# Altium schematic sheet Sheet1.SchDoc
size A3
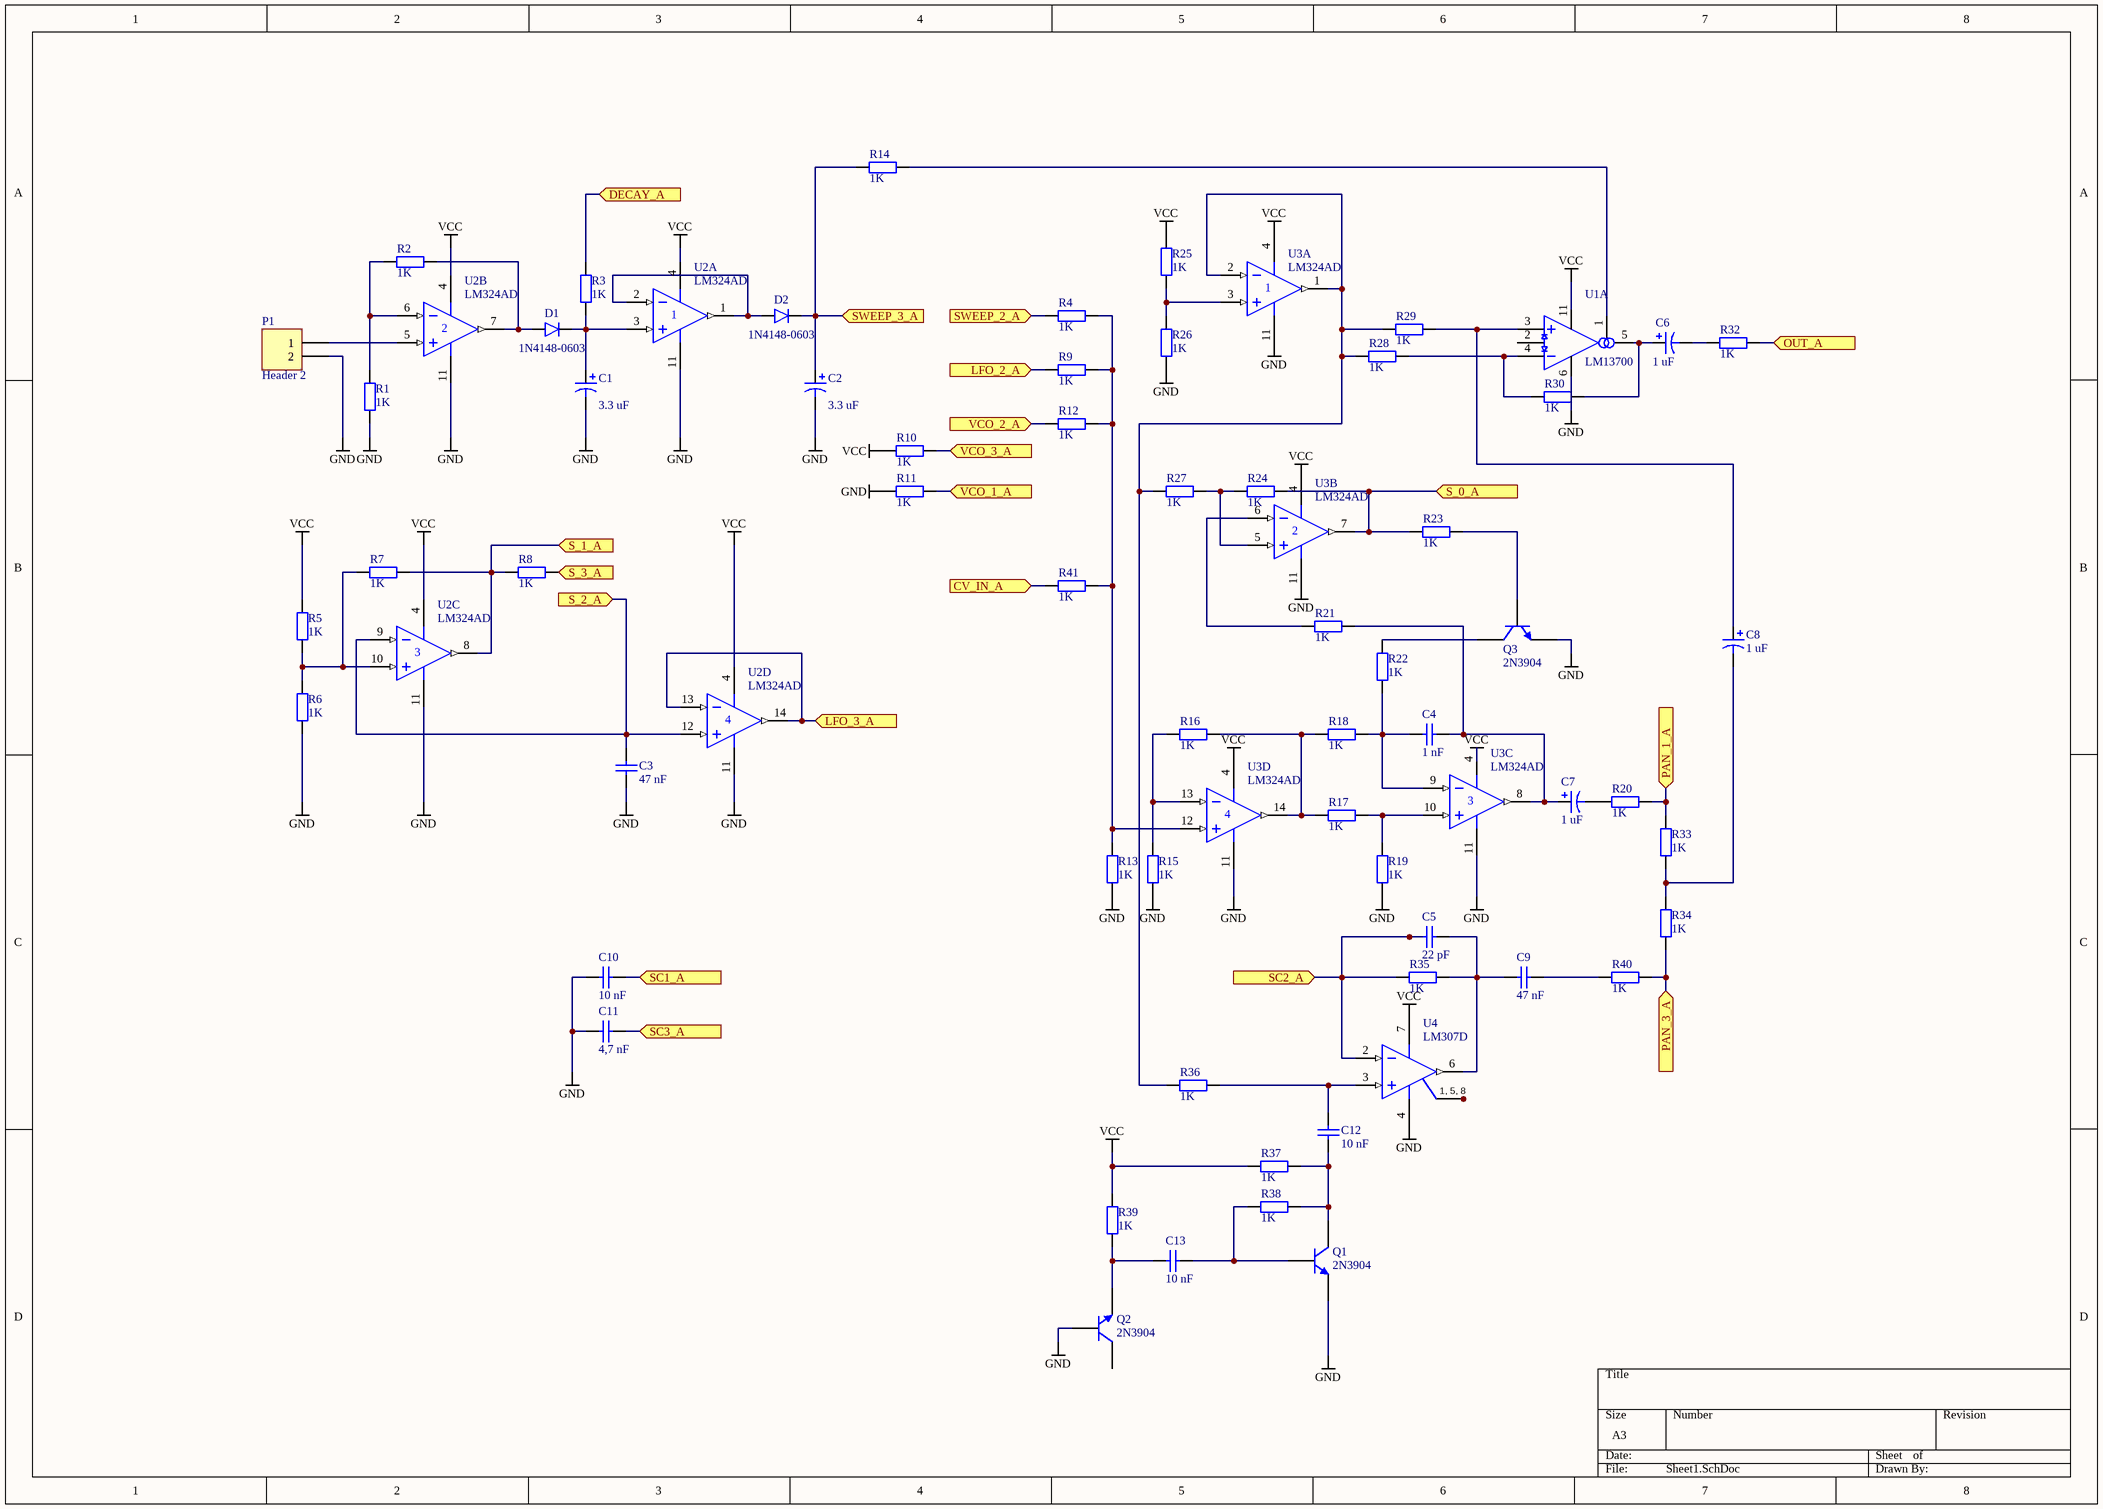
[diagram p0: Sheet1.SchDoc]

## Parts
C1  value 3.3 uF  [C1206]  (hidden comment: Cap Pol1)
C2  value 3.3 uF  [C1206]  (hidden comment: Cap Pol1)
C3  value 47 nF  [C1206]  (hidden comment: Cap)
C4  value 1 nF  [C1206]  (hidden comment: Cap)
C5  value 22 pF  [C1206]  (hidden comment: Cap)
C6  value 1 uF  [C1206]  (hidden comment: Cap Pol1)
C7  value 1 uF  [C1206]  (hidden comment: Cap Pol1)
C8  value 1 uF  [C1206]  (hidden comment: Cap Pol1)
C9  value 47 nF  [C1206]  (hidden comment: Cap)
C10  value 10 nF  [C1206]  (hidden comment: Cap)
C11  value 4,7 nF  [C1206]  (hidden comment: Cap)
C12  value 10 nF  [C1206]  (hidden comment: Cap)
C13  value 10 nF  [C1206]  (hidden comment: Cap)
D1  1N4148-0603  [D0603]
D2  1N4148-0603  [D0603]
P1  Header 2  [HDR1X2]
Q1  2N3904  [TO-92A]
Q2  2N3904  [TO-92A]
Q3  2N3904  [TO-92A]
R1  value 1K  [R1206]  (hidden comment: Res2)
R2  value 1K  [R1206]  (hidden comment: Res2)
R3  value 1K  [R1206]  (hidden comment: Res2)
R4  value 1K  [R1206]  (hidden comment: Res2)
R5  value 1K  [R1206]  (hidden comment: Res2)
R6  value 1K  [R1206]  (hidden comment: Res2)
R7  value 1K  [R1206]  (hidden comment: Res2)
R8  value 1K  [R1206]  (hidden comment: Res2)
R9  value 1K  [R1206]  (hidden comment: Res2)
R10  value 1K  [R1206]  (hidden comment: Res2)
R11  value 1K  [R1206]  (hidden comment: Res2)
R12  value 1K  [R1206]  (hidden comment: Res2)
R13  value 1K  [R1206]  (hidden comment: Res2)
R14  value 1K  [R1206]  (hidden comment: Res2)
R15  value 1K  [R1206]  (hidden comment: Res2)
R16  value 1K  [R1206]  (hidden comment: Res2)
R17  value 1K  [R1206]  (hidden comment: Res2)
R18  value 1K  [R1206]  (hidden comment: Res2)
R19  value 1K  [R1206]  (hidden comment: Res2)
R20  value 1K  [R1206]  (hidden comment: Res2)
R21  value 1K  [R1206]  (hidden comment: Res2)
R22  value 1K  [R1206]  (hidden comment: Res2)
R23  value 1K  [R1206]  (hidden comment: Res2)
R24  value 1K  [R1206]  (hidden comment: Res2)
R25  value 1K  [R1206]  (hidden comment: Res2)
R26  value 1K  [R1206]  (hidden comment: Res2)
R27  value 1K  [R1206]  (hidden comment: Res2)
R28  value 1K  [R1206]  (hidden comment: Res2)
R29  value 1K  [R1206]  (hidden comment: Res2)
R30  value 1K  [R1206]  (hidden comment: Res2)
R32  value 1K  [R1206]  (hidden comment: Res2)
R33  value 1K  [R1206]  (hidden comment: Res2)
R34  value 1K  [R1206]  (hidden comment: Res2)
R35  value 1K  [R1206]  (hidden comment: Res2)
R36  value 1K  [R1206]  (hidden comment: Res2)
R37  value 1K  [R1206]  (hidden comment: Res2)
R38  value 1K  [R1206]  (hidden comment: Res2)
R39  value 1K  [R1206]  (hidden comment: Res2)
R40  value 1K  [R1206]  (hidden comment: Res2)
R41  value 1K  [R1206]  (hidden comment: Res2)
U1  LM13700  [SOIC16]  (part A of 2)
U2  LM324AD  [D014_N]  (parts A,B,C,D of 4)
U3  LM324AD  [D014_N]  (parts A,B,C,D of 4)
U4  LM307D  [D008_L]

## Ports
CV_IN_A, DECAY_A, LFO_2_A, LFO_3_A, OUT_A, PAN_1_A, PAN_3_A, S_0_A, S_1_A, S_2_A, S_3_A, SC1_A, SC2_A, SC3_A, SWEEP_2_A, SWEEP_3_A, VCO_1_A, VCO_2_A, VCO_3_A

## Nets
GND: C1.2 C2.2 C3.1 C10.2 C11.2 P1.2 Q1.1(E) Q2.2(B) Q3.1(E) R1.1 R6.1 R11.2 R13.2 R15.1 R19.2 R26.2 U1.6(V-) U2.11(V-) U3.11(V-) U4.4(V-)
VCC: R5.2 R10.1 R25.1 R37.2 R39.1 U1.11(V+) U2.4(V+) U3.4(V+) U4.7(V+)
CV_IN_A: R41.1 ; port CV_IN_A
DECAY_A: R3.1 ; port DECAY_A
LFO_2_A: R9.2 ; port LFO_2_A
LFO_3_A: U2.13(IN-) U2.14(OUT) ; port LFO_3_A
OUT_A: R32.2 ; port OUT_A
PAN_1_A: R20.2 R33.2 ; port PAN_1_A
PAN_3_A: R34.1 R40.2 ; port PAN_3_A
S_0_A: R23.2 R24.1 U3.7(OUT) ; port S_0_A
S_1_A: R7.1 R8.2 U2.8(OUT) ; port S_1_A
S_2_A: C3.2 U2.9(IN-) U2.12(IN+) ; port S_2_A
S_3_A: R8.1 ; port S_3_A
SC1_A: C10.1 ; port SC1_A
SC2_A: C5.2 R35.2 U4.2(IN-) ; port SC2_A
SC3_A: C11.1 ; port SC3_A
SWEEP_2_A: R4.1 ; port SWEEP_2_A
SWEEP_3_A: C2.1 D2.1 R14.1 ; port SWEEP_3_A
VCO_1_A: R11.1 ; port VCO_1_A
VCO_2_A: R12.2 ; port VCO_2_A
VCO_3_A: R10.2 ; port VCO_3_A
NetC1_1: C1.1 D1.1 R3.2 U2.3(IN+)
NetC4_1: C4.1 C7.1 R21.2 U3.8(OUT)
NetC4_2: C4.2 R18.1 R22.1 U3.9(IN-)
NetC5_1: C5.1 C9.1 R35.1 U4.6(OUT)
NetC6_1: C6.1 R30.2 U1.5(amp_bias)
NetC6_2: C6.2 R32.1
NetC7_2: C7.2 R20.1
NetC8_1: C8.1 R29.2 U1.3(+)
NetC8_2: C8.2 R33.1 R34.2
NetC9_2: C9.2 R40.1
NetC12_1: C12.1 R36.1 U4.3(IN+)
NetC12_2: C12.2 Q1.3(C) R37.1 R38.1
NetC13_1: C13.1 Q2.1(E) R39.2
NetC13_2: C13.2 Q1.2(B) R38.2
NetD1_2: D1.2 R2.1 U2.7(OUT)
NetD2_2: D2.2 U2.1(OUT) U2.2(IN-)
NetP1_1: P1.1 U2.5(IN+)
NetQ3_2: Q3.2(B) R23.1
NetQ3_3: Q3.3(C) R22.2
NetR1_2: R1.2 R2.2 U2.6(IN-)
NetR4_2: R4.2 R9.1 R12.1 R13.1 R41.2 U3.12(IN+)
NetR5_1: R5.1 R6.2 R7.2 U2.10(IN+)
NetR14_2: R14.2 U1.1(amp_bias)
NetR15_2: R15.2 R16.2 U3.13(IN-)
NetR16_1: R16.1 R17.2 R18.2 U3.14(OUT)
NetR17_1: R17.1 R19.1 U3.10(IN+)
NetR21_1: R21.1 U3.6(IN-)
NetR24_2: R24.2 R27.2 U3.5(IN+)
NetR25_2: R25.2 R26.1 U3.3(IN+)
NetR27_1: R27.1 R28.1 R29.1 R36.2 U3.1(OUT) U3.2(IN-)
NetR28_2: R28.2 R30.1 U1.4(amp_bias)
NetU4_1: U4.1(NC) U4.5(NC) U4.8(NC)

Not connected (* = marked no-connect by the designer): Q2 3(C); U1 2(amp_bias)

## Notes on the sheet
- (in symbol LM307D) 1, 5, 8

## Library data of the parts
C1 C2 C6-C8 = Cap Pol1: Polarized Capacitor (Radial); Published: 8-Jun-2000; LatestRevisionDate: 17-Jul-2002; LatestRevisionNote: Re-released for DXP Platform.; PackageReference: RB7.6-15; Publisher: Altium Limited; PackageDescription: Polarized Capacitor (Radial); 2 Leads
C3-C5 C9-C13 = Cap: Capacitor; Published: 8-Jun-2000; LatestRevisionDate: 17-Jul-2002; LatestRevisionNote: Re-released for DXP Platform.; PackageReference: RAD-0.3; Publisher: Altium Limited; PackageDescription: Radial Cap, Thru-Hole; 2 Leads; 0.3 in Pin Spacing
D1 D2 = 1N4148: Dioda: przełączająca; SMD; 100V; 150mA; 4ns; 0603; Manufacture: DC COMPONENTS; Shop1: TME; DafaultFootprint: 0603; Value1: 75V; Parameter1: Vr; Parameter2: If; ComponentLink1URL: http://www.tme.eu/pl/Document/56f18f971963fb7c3e40973a6fd3d82c/CD4148W_WT.pdf; ComponentLink2URL: *; ComponentLink1Description: Datasheet; ComponentLink2Description: *; Tolerance1: *; Shop1ID: *; ComponentType: Diod Rectifier; Assembly: SMD; Replacement: *; ComponentSymbol: 1N4148-0603; Value2: 150mA
P1 = Header 2: Header, 2-Pin; LatestRevisionDate: 17-Jul-2002; LatestRevisionNote: Re-released for DXP Platform.; Publisher: Altium Limited
Q1-Q3 = 2N3904: NPN General Purpose Amplifier; Published: 8-Jun-2000; LatestRevisionDate: 15-Jan-2003; LatestRevisionNote: PCB Footprint 'BCY-W3/D4.7' replaced; DatasheetVersion: 1997; PackageVersion: Sep-1998; PackageReference: TO-92A; Publisher: Altium Limited; PackageDescription: TO, Flat Index; 3 In-Line, Axial Leads; Body Dia. 4.5mm; Leads 0.51 x 0.48 mm (max); ComponentLink1Description: Manufacturer Link; ComponentLink1URL: http://www.fairchildsemi.com/; ComponentLink2Description: Datasheet; ComponentLink2URL: http://www.fairchildsemi.com/ds/2N%2F2N3904.pdf
R1-R30 R32-R41 = Res2: Resistor; Published: 8-Jun-2000; LatestRevisionDate: 17-Jul-2002; LatestRevisionNote: Re-released for DXP Platform.; PackageReference: AXIAL-0.4; Publisher: Altium Limited; PackageDescription: Axial Device, Thru-Hole; 2 Leads; 0.4 in Pin Spacing
U2 U3 = LM324AD: Quadruple Operational Amplifier; Published: 15-Apr-2002; LatestRevisionDate: 13-Apr-2006; LatestRevisionNote: IPC-7351 Footprint Added.; DatasheetVersion: Jan-1989; PackageVersion: Jan-1998; PackageReference: D014; Publisher: Altium Limited; PackageDescription: 14-Pin Small Outline Integrated Circuit 1.27 mm Pitch; Code_IPC: SOIC127P600-14; ComponentLink1Description: Manufacturer Link; ComponentLink1URL: http://www.ti.com/; ComponentLink2Description: Datasheet; ComponentLink2URL: http://www-s.ti.com/sc/ds/lm324.pdf
U4 = LM307D: High-Performance Operational Amplifier; Published: 15-Apr-2002; LatestRevisionDate: 13-Apr-2006; LatestRevisionNote: IPC-7351 Footprint Added.; DatasheetVersion: Jun-1988; PackageVersion: Jan-1998; PackageReference: D008; Publisher: Altium Limited; PackageDescription: 8-Pin Small Outline Integrated Circuit 1.27 mm Pitch; Code_IPC: SOIC127P600-8; ComponentLink1Description: Manufacturer Link; ComponentLink1URL: http://www.ti.com/; ComponentLink2Description: Datasheet; ComponentLink2URL: http://www-s.ti.com/sc/ds/lm307.pdf